# EAGLE design PCB_Maze (EAGLE 8.7.1)
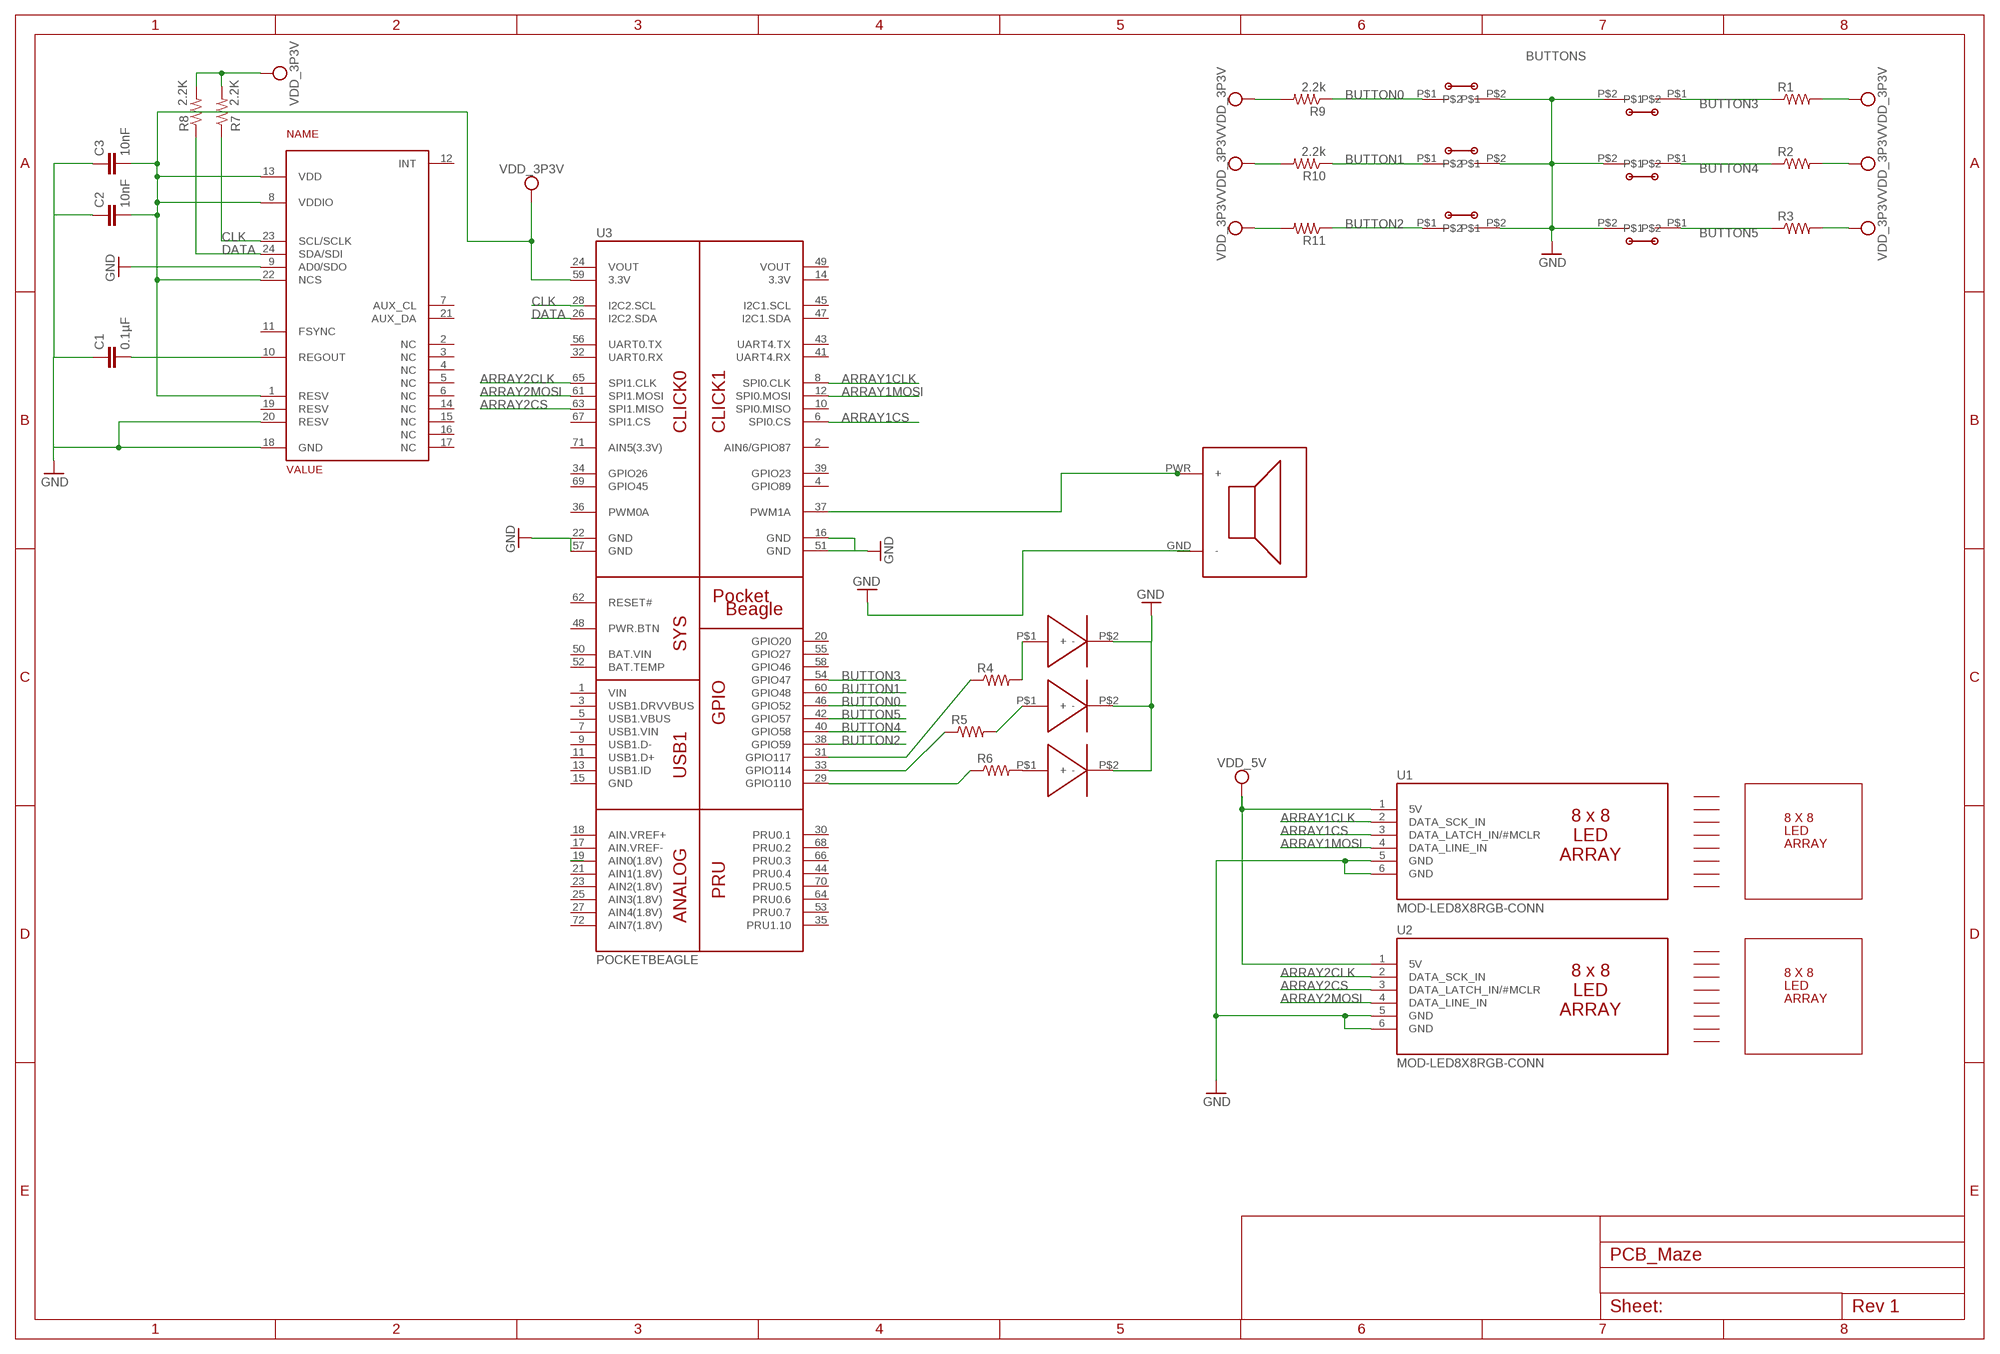
[diagram p0: schematic, sheet 1]

## Parts
C1  0.1µF  C_C0402  [C0402]
C2  10nF  C_C0402  [C0402]
C3  10nF  C_C0402  [C0402]
R1  R_R0402  [R0402]
R2  R_R0402  [R0402]
R3  R_R0402  [R0402]
R4  R_R0402  [R0402]
R5  R_R0402  [R0402]
R6  R_R0402  [R0402]
R7  2.2K  R_R0402  [R0402]
R8  2.2K  R_R0402  [R0402]
R9  2.2k  R_R0402  [R0402]
R10  2.2k  R_R0402  [R0402]
R11  R_R0402  [R0402]
U1  MOD-LED8X8RGB-CONN  [FE06W]
U2  MOD-LED8X8RGB-CONN  [FE06W]
U3  POCKETBEAGLE  [POCKETBEAGLE]
U$1  BUTTON  [SC203]
U$2  BUTTON  [SC203]
U$3  BUTTON  [SC203]
U$5  BUTTON  [SC203]
U$6  BUTTON  [SC203]
U$8  LED  [C191TBKT]
U$9  LED  [C191TBKT]
U$10  LED  [C191TBKT]
U$11  BUZZER  [CEM-1203]
U$12  MPU9250  [QFN_3MMX3MM]
U$13  BUTTON  [SC203]

## Nets
ARRAY1CLK: U1.2(DATA_SCK_IN) U3.8(SPI0.CLK)
ARRAY1CS: U1.3(DATA_LATCH_IN/#MCLR) U3.6(SPI0.CS)
ARRAY1MOSI: U1.4(DATA_LINE_IN) U3.12(SPI0.MOSI)
ARRAY2CLK: U2.2(DATA_SCK_IN) U3.65(SPI1.CLK)
ARRAY2CS: U2.3(DATA_LATCH_IN/#MCLR) U3.63(SPI1.MISO)
ARRAY2MOSI: U2.4(DATA_LINE_IN) U3.61(SPI1.MOSI)
BUTTON0: R9.1 U3.46(GPIO52) U$5.P$1
BUTTON1: R10.1 U3.60(GPIO48) U$6.P$1
BUTTON2: R11.1 U3.38(GPIO59) U$13.P$1
BUTTON3: R1.1 U3.54(GPIO47) U$1.P$1
BUTTON4: R2.1 U3.40(GPIO58) U$2.P$1
BUTTON5: R3.1 U3.42(GPIO57) U$3.P$1
CLK: R7.1 U3.28(I2C2.SCL) U$12.23(SCL/SCLK)
DATA: R8.1 U3.26(I2C2.SDA) U$12.24(SDA/SDI)
GND: C1.1 C2.1 C3.1 U1.5(GND) U1.6(GND) U2.5(GND) U2.6(GND) U3.16(GND) U3.22(GND) U3.51(GND) U3.57(GND) U$1.P$2 U$2.P$2 U$3.P$2 U$5.P$2 U$6.P$2 U$8.P$2(-) U$9.P$2(-) U$10.P$2(-) U$12.9(AD0/SDO) U$12.18(GND) U$12.20(RESV) U$13.P$2
N$1: C1.2 U$12.10(REGOUT)
N$2: R6.1 U3.29(GPIO110)
N$3: R6.2 U$10.P$1(+)
N$5: R5.1 U3.33(GPIO114)
N$7: U3.37(PWM1A) U$11.PWR(+)
N$8: R5.2 U$9.P$1(+)
N$9: R4.2 U$8.P$1(+)
N$10: R4.1 U3.31(GPIO117)
N$15: U3.19(AIN0(1.8V))
SYS_VDD1_3P3V: C2.2 C3.2 R1.2 R2.2 R3.2 R7.2 R8.2 R9.2 R10.2 R11.2 U3.59(3.3V) U$12.1(RESV) U$12.8(VDDIO) U$12.13(VDD) U$12.22(NCS) ; supply symbol labelled VDD_3P3V
SYS_VDD1_5V: U1.1(5V) U2.1(5V) ; supply symbol labelled VDD_5V
Unconnected: U3.1(VIN) U3.2(AIN6/GPIO87) U3.3(USB1.DRVVBUS) U3.4(GPIO89) U3.5(USB1.VBUS) U3.7(USB1.VIN) U3.9(USB1.D-) U3.10(SPI0.MISO) U3.11(USB1.D+) U3.13(USB1.ID) U3.14(3.3V) U3.15(GND) U3.17(AIN.VREF-) U3.18(AIN.VREF+) U3.20(GPIO20) U3.21(AIN1(1.8V)) U3.23(AIN2(1.8V)) U3.24(VOUT) U3.25(AIN3(1.8V)) U3.27(AIN4(1.8V)) U3.30(PRU0.1) U3.32(UART0.RX) U3.34(GPIO26) U3.35(PRU1.10) U3.36(PWM0A) U3.39(GPIO23) U3.41(UART4.RX) U3.43(UART4.TX) U3.44(PRU0.4) U3.45(I2C1.SCL) U3.47(I2C1.SDA) U3.48(PWR.BTN) U3.49(VOUT) U3.50(BAT.VIN) U3.52(BAT.TEMP) U3.53(PRU0.7) U3.55(GPIO27) U3.56(UART0.TX) U3.58(GPIO46) U3.62(RESET#) U3.64(PRU0.6) U3.66(PRU0.3) U3.67(SPI1.CS) U3.68(PRU0.2) U3.69(GPIO45) U3.70(PRU0.5) U3.71(AIN5(3.3V)) U3.72(AIN7(1.8V)) U$11.GND(-) U$12.2(NC) U$12.3(NC) U$12.4(NC) U$12.5(NC) U$12.6(NC) U$12.7(AUX_CL) U$12.11(FSYNC) U$12.12(INT) U$12.14(NC) U$12.15(NC) U$12.16(NC) U$12.17(NC) U$12.19(RESV) U$12.21(AUX_DA)

## Notes on the sheet
- BUTTONS
- 8 X 8
- LED
- ARRAY
- 8 X 8
- LED
- ARRAY

## Library data of the parts
C1-C3 = ENGI301_design_example:C_: Capacitor SMD. Sizes: 0402, 0603 & 0805
R1-R11 = ENGI301_PCB_design:R_: RESISTOR, American symbol
U1 U2 = ENGI301_Maze_Project_Parts:MOD-LED8X8RGB-CONN
U3 = ENGI301_PCB_design:POCKETBEAGLE
U$1-U$3 U$5 U$6 U$13 = ENGI301_PCB_design:BUTTON
U$8-U$10 = ENGI301_PCB_design:LED
U$11 = ENGI301_PCB_design:BUZZER
U$12 = ENGI301_PCB_design:MPU9250

## Board
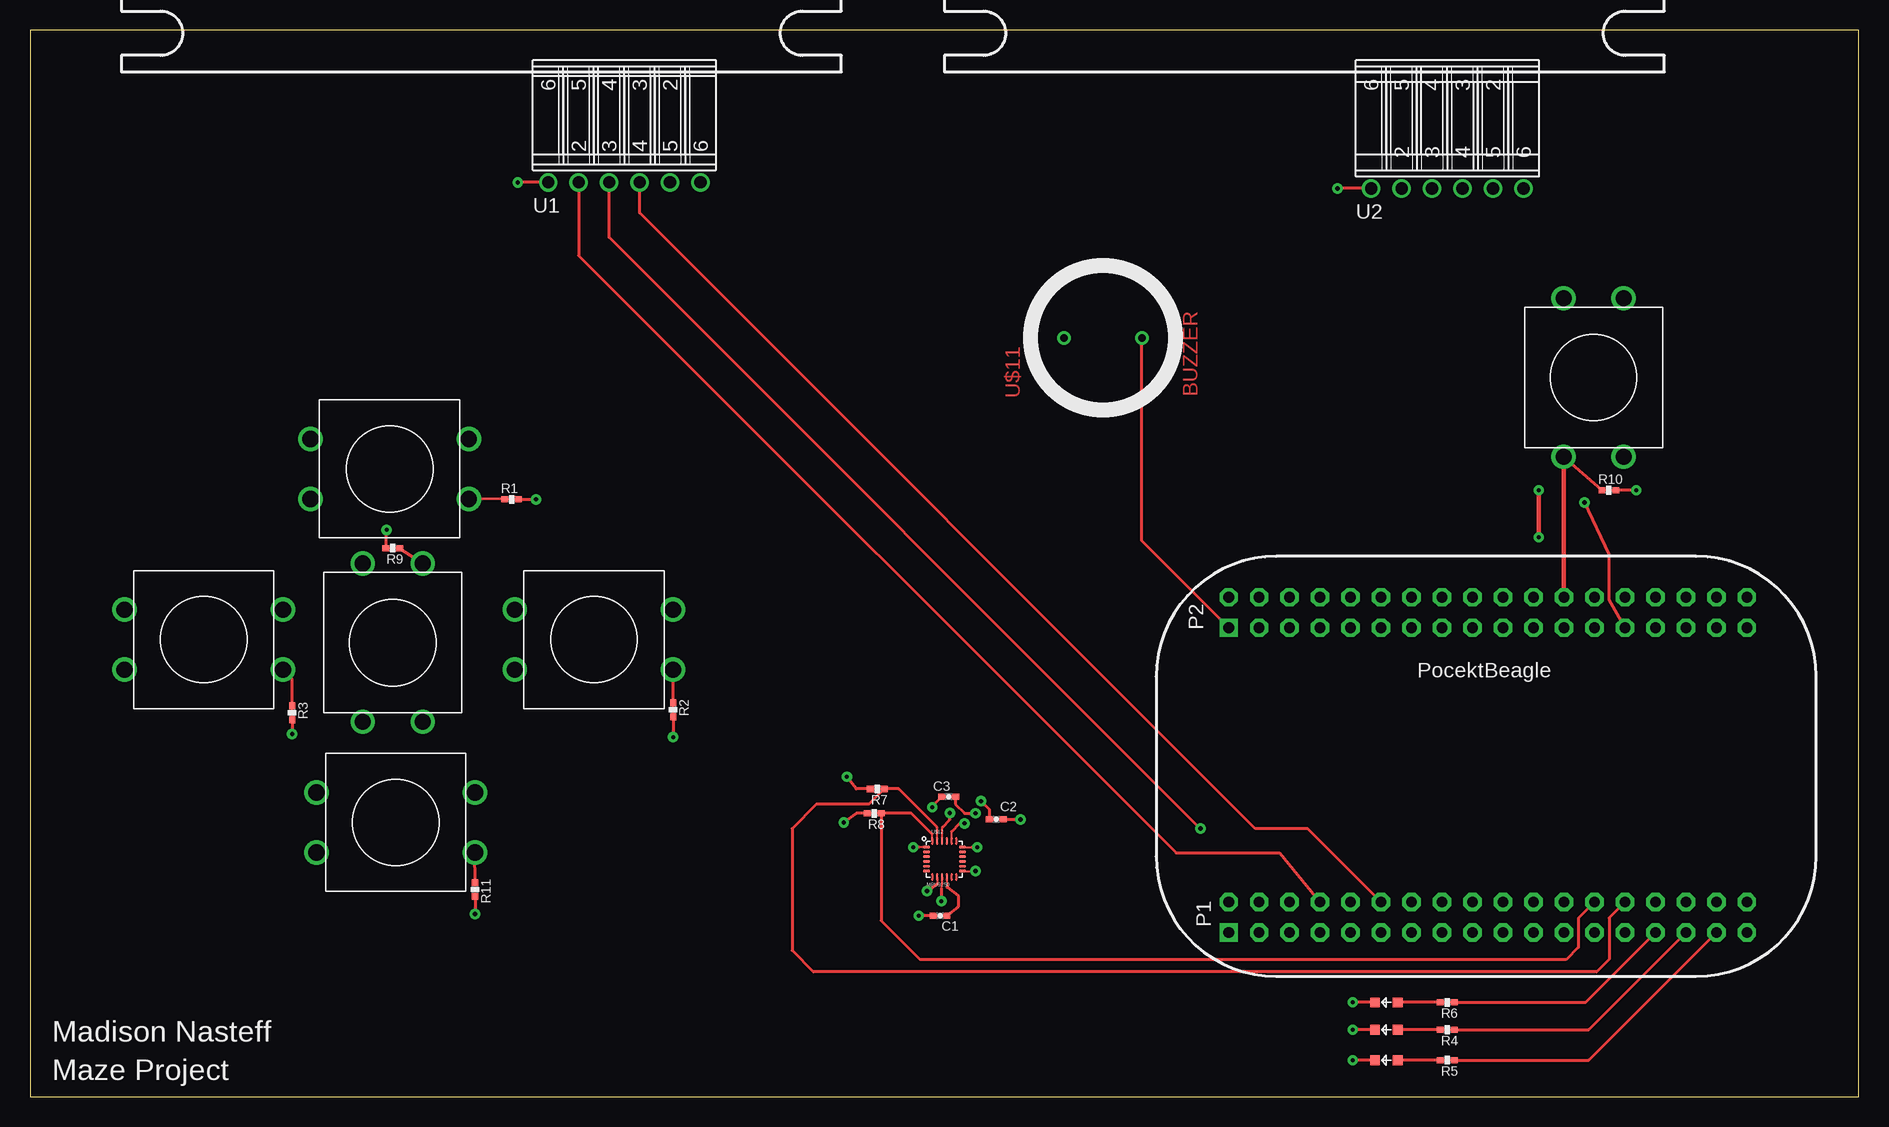
[diagram p1: board, top side]
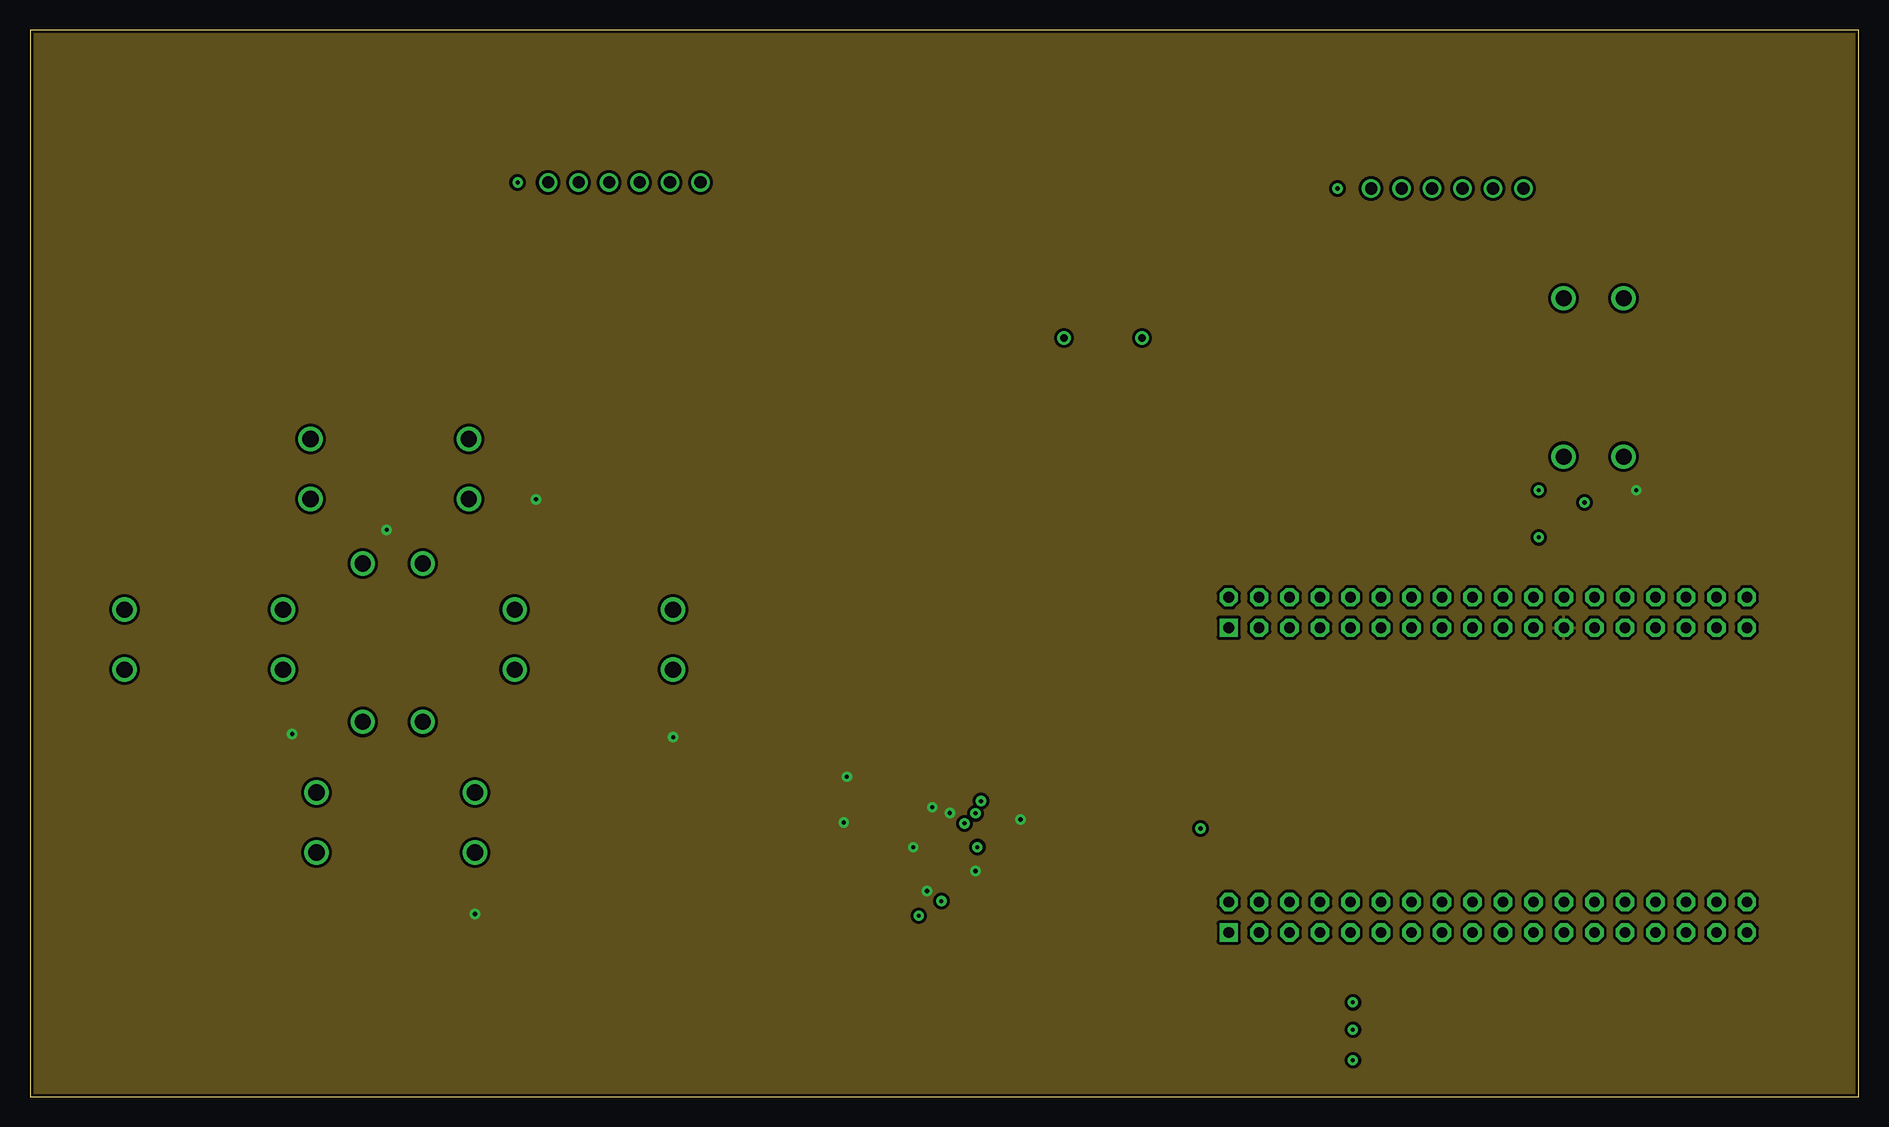
[diagram p2: board, inner layer Route2]
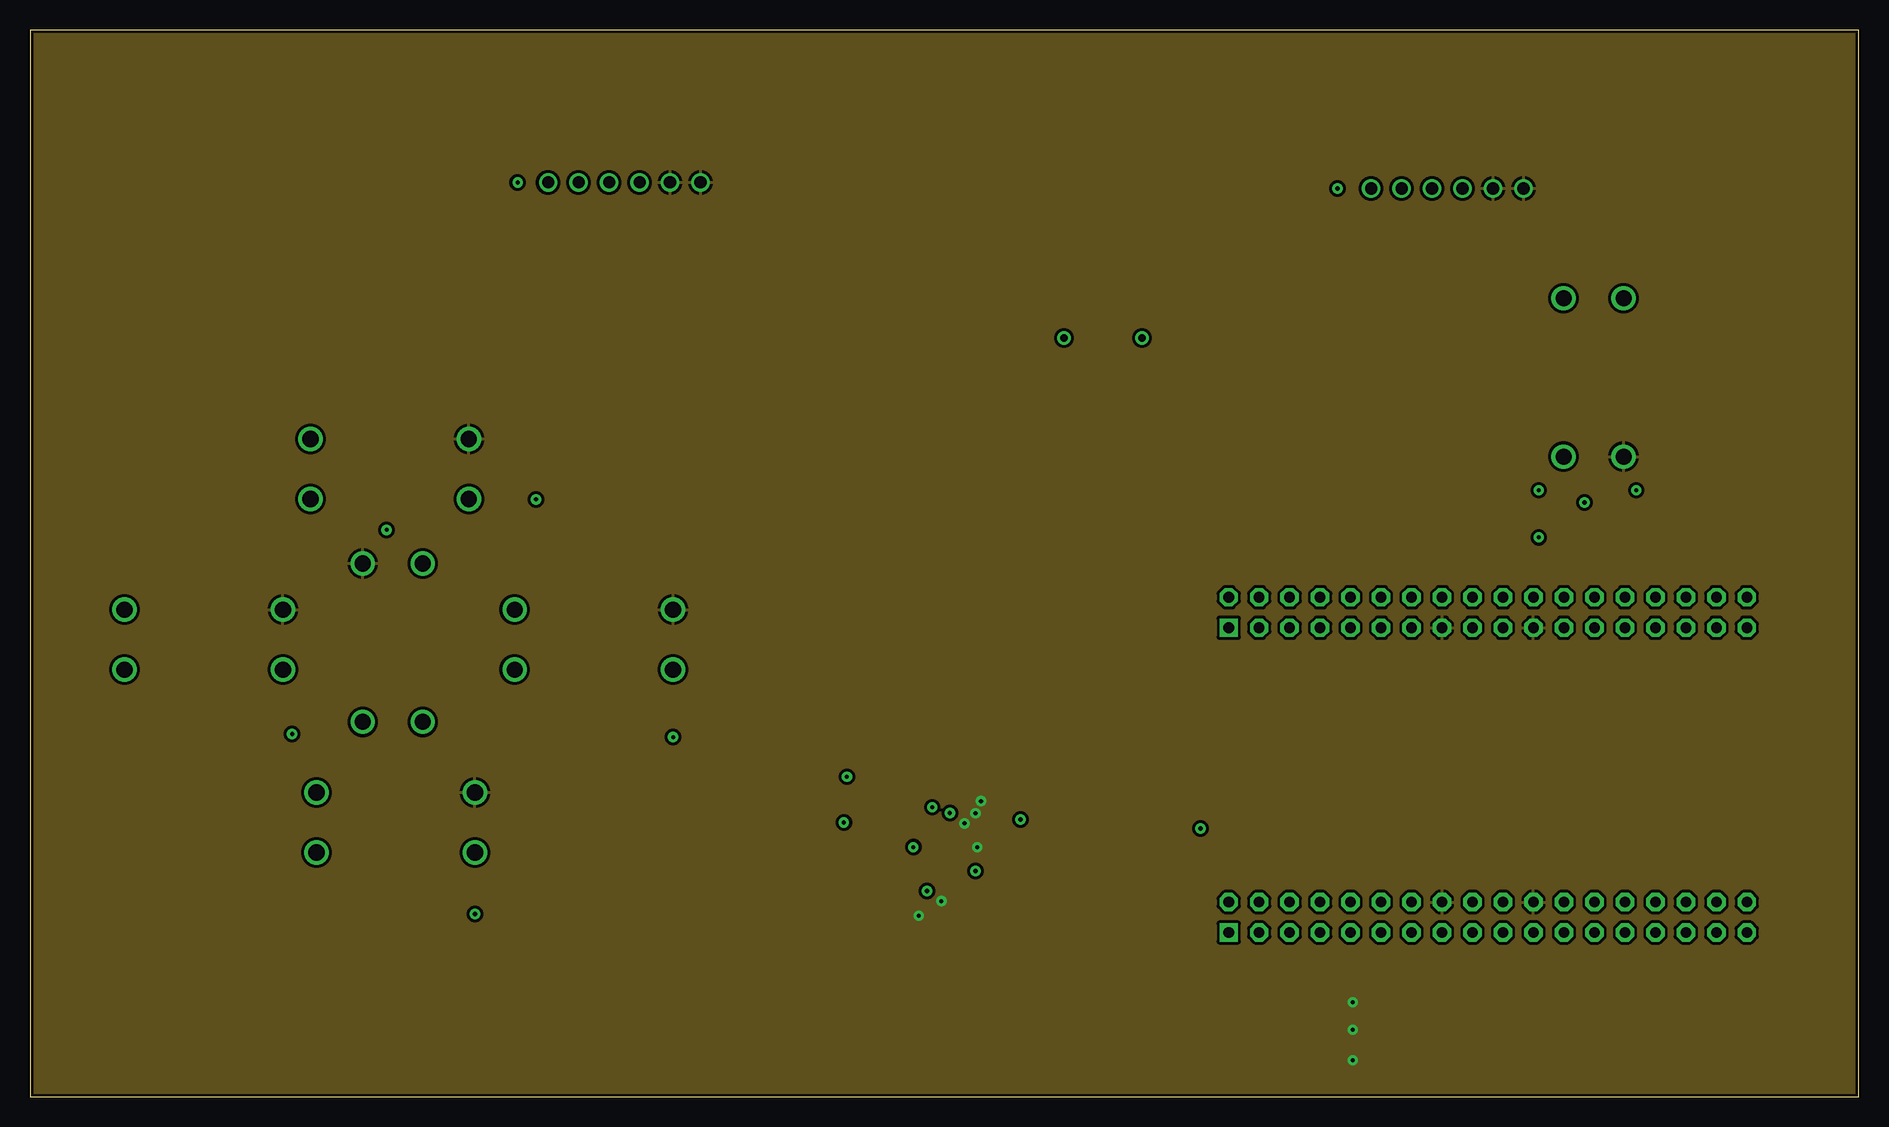
[diagram p3: board, inner layer Route15]
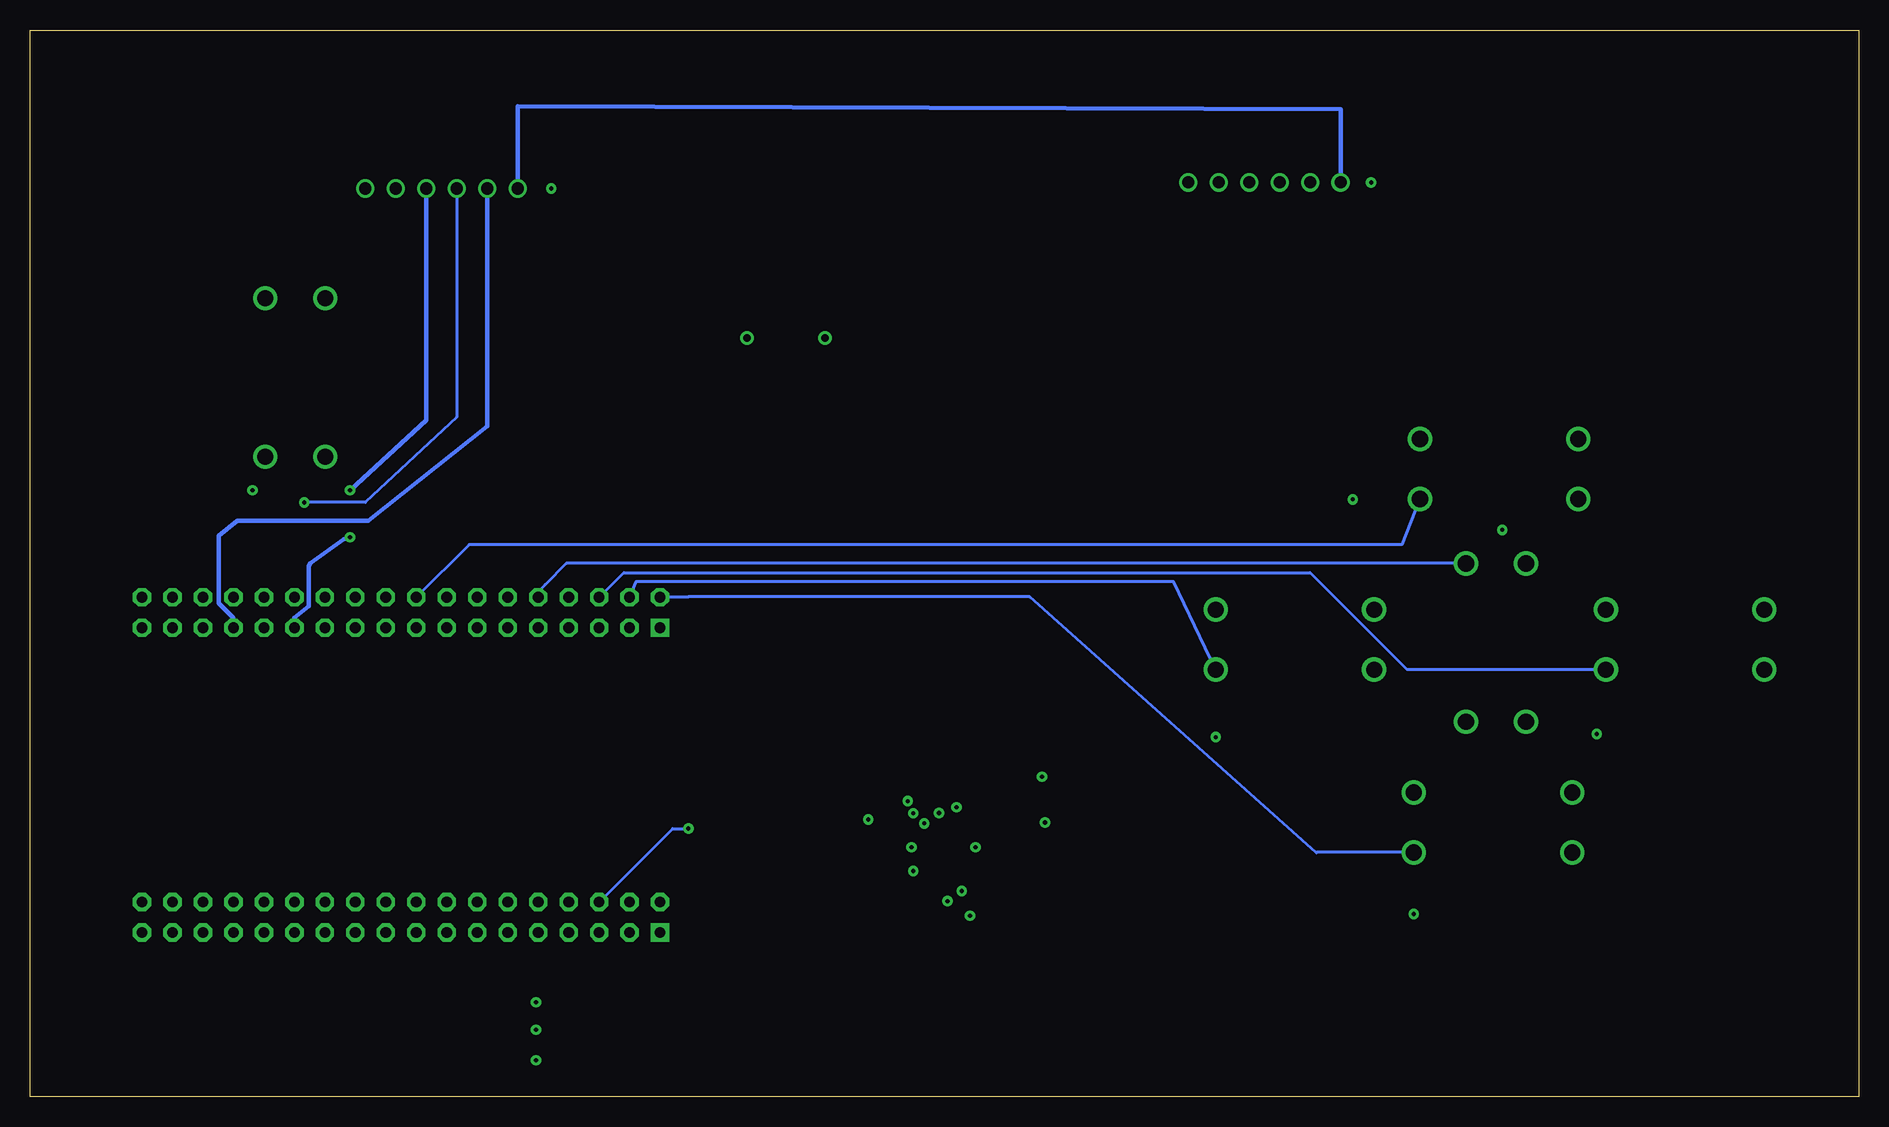
[diagram p4: board, bottom side, seen from below]

Size 152.4 x 88.9 mm. Coordinates in mm from the lower left corner, seen from the top.
Outline: 0,0 152.4,0 152.4,88.9 0,88.9 0,0
Copper layers (1*2*15*16): Top 0.035mm / dielectric 0.23mm / Route2 0.035mm / dielectric 0.93mm / Route15 0.035mm / dielectric 0.23mm / Bottom 0.035mm
Design rules "ENGI301_Maze_Project_4lyr": minimum track width 10mil, minimum drill 12mil, track to track 10mil, track to pad 10mil, pad to pad 10mil, via to via 10mil, smd to smd 10mil, copper to edge 10mil, drill to drill 12mil, minimum pad ring 10mil, minimum via ring 10mil, stop-mask expansion 3mil, vias tented up to drill 25mil, thermal gap 10mil

### Footprints (pad centres in the part's own frame; a part is rotated, then mirrored left to right if it is on the bottom)
C0402 = smd 0.61 x 0.508: 1 -0.559,0; 2 0.559,0
R0402 = smd 0.61 x 0.508: 1 -0.559,0; 2 0.559,0
FE06W = drill 1.016: 1 -6.35,0; 2 -3.81,0; 3 -1.27,0; 4 1.27,0; 5 3.81,0; 6 6.35,0
POCKETBEAGLE = drill 0.889 pad 1.524 square: 1 5.91,3.53; 37 5.91,28.93 | drill 0.889 pad 1.524 octagon: 2 5.91,6.07; 3 8.45,3.53; 4 8.45,6.07; 5 10.99,3.53; 6 10.99,6.07; 7 13.53,3.53; 8 13.53,6.07; 9 16.07,3.53; 10 16.07,6.07; 11 18.61,3.53; 12 18.61,6.07; 13 21.15,3.53; 14 21.15,6.07; 15 23.69,3.53; 16 23.69,6.07; 17 26.23,3.53; 18 26.23,6.07; 19 28.77,3.53; 20 28.77,6.07; 21 31.31,3.53; 22 31.31,6.07; 23 33.85,3.53; 24 33.85,6.07; 25 36.39,3.53; 26 36.39,6.07; 27 38.93,3.53; 28 38.93,6.07; 29 41.47,3.53; 30 41.47,6.07; 31 44.01,3.53; 32 44.01,6.07; 33 46.55,3.53; 34 46.55,6.07; 35 49.09,3.53; 36 49.09,6.07; 38 5.91,31.47; 39 8.45,28.93; 40 8.45,31.47; 41 10.99,28.93; 42 10.99,31.47; 43 13.53,28.93; 44 13.53,31.47; 45 16.07,28.93; 46 16.07,31.47; 47 18.61,28.93; 48 18.61,31.47; 49 21.15,28.93; 50 21.15,31.47; 51 23.69,28.93; 52 23.69,31.47; 53 26.23,28.93; 54 26.23,31.47; 55 28.77,28.93; 56 28.77,31.47; 57 31.31,28.93; 58 31.31,31.47; 59 33.85,28.93; 60 33.85,31.47; 61 36.39,28.93; 62 36.39,31.47; 63 38.93,28.93; 64 38.93,31.47; 65 41.47,28.93; 66 41.47,31.47; 67 44.01,28.93; 68 44.01,31.47; 69 46.55,28.93; 70 46.55,31.47; 71 49.09,28.93; 72 49.09,31.47
SC203 = drill 1.35: P$1 -6.6,2.5; P$2 -6.6,-2.5; P$3 6.6,2.5; P$4 6.6,-2.5
C191TBKT = smd 0.8 x 0.8: P$1 -0.95,0; P$2 0.95,0
CEM-1203 = drill 0.625: GND 0,3.25; PWR 0,-3.25
QFN_3MMX3MM = smd 0.6 x 0.2: 1 -1.5,1; 2 -1.5,0.6; 3 -1.5,0.2; 4 -1.5,-0.2; 5 -1.5,-0.6; 6 -1.5,-1; 13 1.5,-1; 14 1.5,-0.6; 15 1.5,-0.2; 16 1.5,0.2; 17 1.5,0.6; 18 1.5,1 | smd 0.2 x 0.6: 7 -1,-1.5; 8 -0.6,-1.5; 9 -0.2,-1.5; 10 0.2,-1.5; 11 0.6,-1.5; 12 1,-1.5; 19 1,1.5; 20 0.6,1.5; 21 0.2,1.5; 22 -0.2,1.5; 23 -0.6,1.5; 24 -1,1.5

### Placement (x,y rotation side)
C1  75.84,15.09 0 top
C2  80.52,23.11 0 top
C3  76.56,25.02 180 top
R1  40.13,49.78 0 top
R2  53.59,32.26 270 top
R3  21.84,32 270 top
R4  118.11,5.59 180 top
R5  118.11,3.05 180 top
R6  118.11,7.87 180 top
R7  70.61,25.65 180 top
R8  70.36,23.62 180 top
R9  30.23,45.72 180 top
R10  131.57,50.55 0 top
R11  37.08,17.27 270 top
U1  49.53,76.2 0 top
U2  118.11,75.69 0 top
U3  93.98,10.16 0 top
U$1  29.97,52.32 180 top
U$2  46.99,38.1 180 top
U$3  14.48,38.1 180 top
U$4  [MOD-LED8X8RGB]  7.62,144.78 270 top  (outside the outline)
U$5  30.23,37.85 270 top
U$6  130.3,59.94 90 top
U$7  [MOD-LED8X8RGB]  7.62,205.74 270 top  (outside the outline)
U$8  113.03,5.59 180 top
U$9  113.03,3.05 180 top
U$10  113.03,7.87 180 top
U$11  89.41,63.25 90 top
U$12  76.2,19.81 0 top
U$13  30.48,22.86 180 top
U$14  [MOD-LED8X8RGB]  76.2,144.78 270 top  (outside the outline)
U$15  [MOD-LED8X8RGB]  76.2,205.74 270 top  (outside the outline)

### Tracks (layer width: path | path; a pad name or v marks a point on that pad's centre or on a via)
ARRAY1CLK
  Top 0.254: U3.8 104.14,20.32 95.5,20.32 45.72,70.1 U1.2
ARRAY1CS  (via drill 0.35)
  Top 0.254: v97.54,22.35 48.26,71.63 U1.3
  Bottom 0.254: U3.6 98.85,22.35 v97.54,22.35
ARRAY1MOSI
  Top 0.254: U3.12 106.47,22.35 102.11,22.35 50.8,73.66 U1.4
ARRAY2CLK
  Bottom 0.381: U2.2 114.3,55.88 124.21,48.01 135.13,48.01 136.66,46.74 136.66,41.13 135.45,39.92 U3.65
ARRAY2CS  (via drill 0.35)
  Top 0.254: v129.54,49.53 131.57,45.21 131.57,41.4 U3.63
  Bottom 0.254: U2.3 116.84,56.64 124.46,49.53 v129.54,49.53
ARRAY2MOSI  (via drill 0.35)
  Top 0.381: v125.73,46.62 v125.73,50.55
  Bottom 0.381: U3.61 130.37,39.92 129.16,40.89 129.16,44.2 129.03,44.45 126.24,46.48 v125.73,46.62 | v125.73,50.55 119.38,56.39 U2.4
BUTTON0
  Top 0.254: R9.1 U$5.P$1
  Bottom 0.254: U$5.P$1 107.7,44.45 109.47,42.67 110.05,42.1 U3.46
BUTTON1
  Top 0.254: R10.1 U$6.P$1
  Top 0.381: U$6.P$1 U3.60
BUTTON2
  Top 0.254: R11.1 U$13.P$1
  Bottom 0.254: U$13.P$1 45.17,20.36 45.21,20.32 69.09,41.66 97.54,41.66 97.56,41.63 U3.38
BUTTON3
  Top 0.254: R1.1 U$1.P$1
  Bottom 0.254: U$1.P$1 38.09,46.02 115.81,46.02 U3.54
BUTTON4
  Top 0.254: R2.1 U$2.P$1
  Bottom 0.254: U$2.P$1 57.11,42.93 101.9,42.93 U3.40
BUTTON5
  Top 0.254: R3.1 21.84,34.83 U$3.P$1
  Bottom 0.254: U$3.P$1 37.63,35.6 45.72,43.69 102.91,43.69 U3.42
CLK
  Top 0.152: U$12.23 75.6,22.44 75.59,22.45
  Top 0.254: 75.59,22.45 72.39,25.65 R7.1 69.9,24.38 65.53,24.38 63.5,22.35 63.5,12.19 65.28,10.41 130.56,10.41 131.6,11.46 131.6,14.92 U3.28
DATA
  Top 0.152: U$12.24 75.18,21.89
  Top 0.254: 75.18,21.89 73.46,23.62 R8.1 70.92,14.68 74.17,11.43 128.02,11.43 129.03,12.45 129.03,14.89 U3.26
GND  (via drill 0.35)
  Top 0.152: U$12.18 78.48,20.81 78.49,20.8 | U$12.9 75.95,17.37 | U$12.20 76.81,22.1
  Top 0.254: C1.1 v74.07,15.09 | U$10.P$2 v110.24,7.87 | U$8.P$2 v110.24,5.59 | U$9.P$2 v110.24,3.05 | C2.1 79.96,23.93 v79.25,24.64 | 78.49,20.8 v78.94,20.8 | 75.95,17.37 v75.95,16.31 | 76.81,22.1 77.5,22.78 v77.88,22.78 | C3.1 77.11,24.38 77.88,23.62 v78.79,23.62
  pour Route15: -2.54,-2.54 -2.54,91.44 154.94,91.44 154.94,-2.54
N$1
  Top 0.152: C1.2 | U$12.10 76.43,17.45
  Top 0.254: 76.43,17.45 77.34,16.76 77.34,15.85 C1.2
N$2
  Top 0.254: R6.1 129.63,7.87 U3.29
N$3
  Top 0.254: R6.2 U$10.P$1
N$5
  Top 0.254: R5.1 129.89,3.05 U3.33
N$7
  Top 0.254: U3.37 92.66,46.32 U$11.PWR
N$8
  Top 0.254: R5.2 U$9.P$1
N$9
  Top 0.254: R4.2 U$8.P$1
N$10
  Top 0.254: R4.1 129.89,5.59 U3.31
SYS_VDD1_3P3V  (via drill 0.35)
  Top 0.152: U$12.1 74.08,20.81 74.07,20.8 | U$12.13 78.4,18.81 78.41,18.82 | U$12.8 75.59,17.75 | U$12.22 76,22.43 76.05,22.48
  Top 0.254: R2.2 v53.59,29.97 | R3.2 v21.84,30.23 | R11.2 v37.08,15.24 | R1.2 v42.16,49.78 | R9.2 29.67,47.19 v29.72,47.24 | C2.2 v82.55,23.11 | C3.2 75.18,24.21 v75.18,24.13 | R7.2 68.83,25.65 v68.07,26.67 | R8.2 68.83,23.62 v67.82,22.86 | 74.07,20.8 v73.61,20.8 | 78.41,18.82 v78.79,18.82 | 75.59,17.75 v74.75,17.14 | v133.86,50.55 R10.2 | 76.05,22.48 76.66,23.09 v76.66,23.65
  pour Route2: -5.08,-5.08 -5.08,93.98 157.48,93.98 157.48,-5.08
SYS_VDD1_5V  (via drill 0.35)
  Top 0.254: U2.1 v108.97,75.69 | U1.1 v40.64,76.2
  Bottom 0.381: U1.1 43.18,82.3 111.76,82.55 U2.1

### Text on the board
tNames: Madison Nasteff | Maze Project